# Altium schematic sheet DAC_IO.SchDoc: DAC IO Board
size Tabloid; Date: 05/10/2023; Engineer: Terry D. Schevler; Revision: 1.0; SheetNumber: 1; SheetTotal: 3
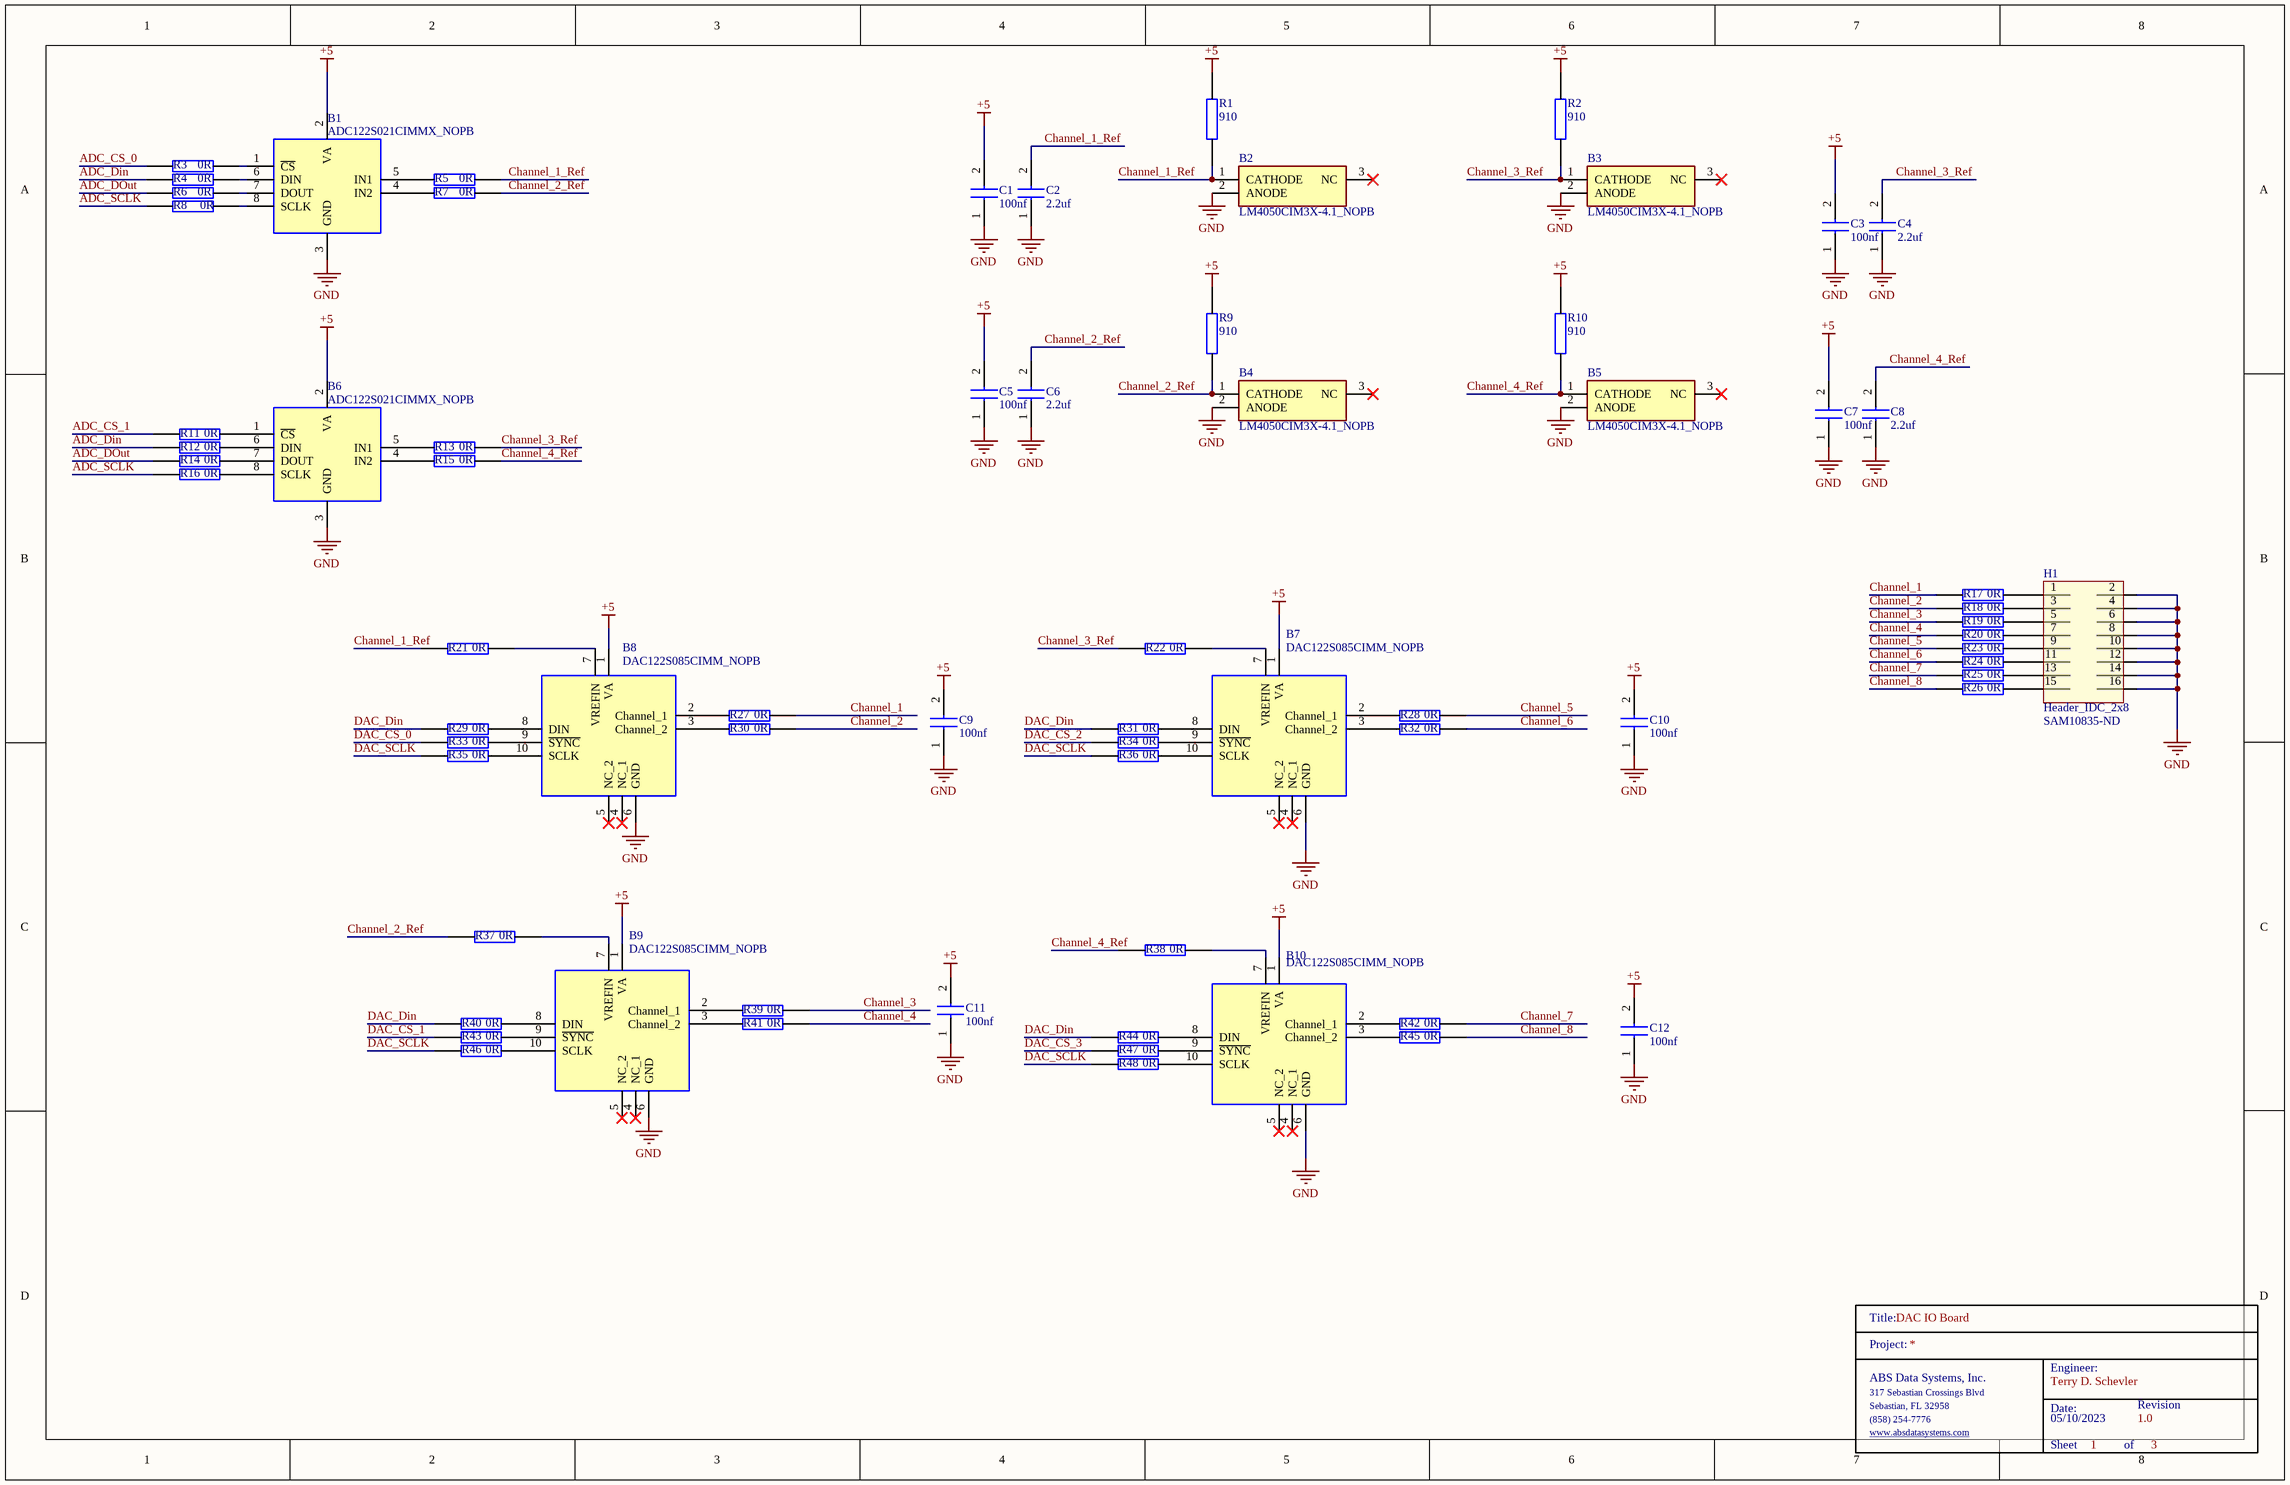
[diagram p0: DAC_IO.SchDoc]

## Parts
B1  ADC122S021CIMMX_NOPB  [SOP65P490X110-8N]
B2  LM4050CIM3X-4.1_NOPB  [SOT95P237X95-3N]
B3  LM4050CIM3X-4.1_NOPB  [SOT95P237X95-3N]
B4  LM4050CIM3X-4.1_NOPB  [SOT95P237X95-3N]
B5  LM4050CIM3X-4.1_NOPB  [SOT95P237X95-3N]
B6  ADC122S021CIMMX_NOPB  [SOP65P490X110-8N]
B7  DAC122S085CIMM_NOPB  [SOP50P490X110-10N]
B8  DAC122S085CIMM_NOPB  [SOP50P490X110-10N]
B9  DAC122S085CIMM_NOPB  [SOP50P490X110-10N]
B10  DAC122S085CIMM_NOPB  [SOP50P490X110-10N]
C1  100nf  [0603]
C2  2.2uf  [0603]
C3  100nf  [0603]
C4  2.2uf  [0603]
C5  100nf  [0603]
C6  2.2uf  [0603]
C7  100nf  [0603]
C8  2.2uf  [0603]
C9  100nf  [0603]
C10  100nf  [0603]
C11  100nf  [0603]
C12  100nf  [0603]
H1  Header_IDC_2x8  Supplier Part Number 1: SAM10835-ND  [HEADER16]
R1  910  [0603]
R2  910  [0603]
R3  0R  [0603]
R4  0R  [0603]
R5  0R  [0603]
R6  0R  [0603]
R7  0R  [0603]
R8  0R  [0603]
R9  910  [0603]
R10  910  [0603]
R11  0R  [0603]
R12  0R  [0603]
R13  0R  [0603]
R14  0R  [0603]
R15  0R  [0603]
R16  0R  [0603]
R17  0R  [0603]
R18  0R  [0603]
R19  0R  [0603]
R20  0R  [0603]
R21  0R  [0603]
R22  0R  [0603]
R23  0R  [0603]
R24  0R  [0603]
R25  0R  [0603]
R26  0R  [0603]
R27  0R  [0603]
R28  0R  [0603]
R29  0R  [0603]
R30  0R  [0603]
R31  0R  [0603]
R32  0R  [0603]
R33  0R  [0603]
R34  0R  [0603]
R35  0R  [0603]
R36  0R  [0603]
R37  0R  [0603]
R38  0R  [0603]
R39  0R  [0603]
R40  0R  [0603]
R41  0R  [0603]
R42  0R  [0603]
R43  0R  [0603]
R44  0R  [0603]
R45  0R  [0603]
R46  0R  [0603]
R47  0R  [0603]
R48  0R  [0603]
TitleBlock_1  TitleBlock  (value not drawn)  (graphical)

## Nets
+5: B1.2(VA) B6.2(VA) B7.1(VA) B8.1(VA) B9.1(VA) B10.1(VA) C1.2 C3.2 C5.2 C7.2 C9.2 C10.2 C11.2 C12.2 R1.1 R2.1 R9.1 R10.1
GND: B1.3(GND) B2.2(ANODE) B3.2(ANODE) B4.2(ANODE) B5.2(ANODE) B6.3(GND) B7.6(GND) B8.6(GND) B9.6(GND) B10.6(GND) C1.1 C2.1 C3.1 C4.1 C5.1 C6.1 C7.1 C8.1 C9.1 C10.1 C11.1 C12.1 H1.2 H1.4 H1.6 H1.8 H1.10 H1.12 H1.14 H1.16
ADC_CS_0: R3.1
ADC_CS_1: R11.1
ADC_Din: R4.1 R12.1
ADC_DOut: R6.1 R14.1
ADC_SCLK: R8.1 R16.1
Channel_1: R17.1 R27.2
Channel_1_Ref: B2.1(CATHODE) C2.2 R1.2 R5.2 R21.1
Channel_2: R18.1 R30.2
Channel_2_Ref: B4.1(CATHODE) C6.2 R7.2 R9.2 R37.1
Channel_3: R19.1 R39.2
Channel_3_Ref: B3.1(CATHODE) C4.2 R2.2 R13.2 R22.1
Channel_4: R20.1 R41.2
Channel_4_Ref: B5.1(CATHODE) C8.2 R10.2 R15.2 R38.1
Channel_5: R23.1 R28.2
Channel_6: R24.1 R32.2
Channel_7: R25.1 R42.2
Channel_8: R26.1 R45.2
DAC_CS_0: R33.1
DAC_CS_1: R43.1
DAC_CS_2: R34.1
DAC_CS_3: R47.1
DAC_Din: R29.1 R31.1 R40.1 R44.1
DAC_SCLK: R35.1 R36.1 R46.1 R48.1
NetB1_1: B1.1(~{CS}) R3.2
NetB1_4: B1.4(IN2) R7.1
NetB1_5: B1.5(IN1) R5.1
NetB1_6: B1.6(DIN) R4.2
NetB1_7: B1.7(DOUT) R6.2
NetB1_8: B1.8(SCLK) R8.2
NetB6_1: B6.1(~{CS}) R11.2
NetB6_4: B6.4(IN2) R15.1
NetB6_5: B6.5(IN1) R13.1
NetB6_6: B6.6(DIN) R12.2
NetB6_7: B6.7(DOUT) R14.2
NetB6_8: B6.8(SCLK) R16.2
NetB7_2: B7.2(Channel_1) R28.1
NetB7_3: B7.3(Channel_2) R32.1
NetB7_7: B7.7(VREFIN) R22.2
NetB7_8: B7.8(DIN) R31.2
NetB7_9: B7.9(~{SYNC}) R34.2
NetB7_10: B7.10(SCLK) R36.2
NetB8_2: B8.2(Channel_1) R27.1
NetB8_3: B8.3(Channel_2) R30.1
NetB8_7: B8.7(VREFIN) R21.2
NetB8_8: B8.8(DIN) R29.2
NetB8_9: B8.9(~{SYNC}) R33.2
NetB8_10: B8.10(SCLK) R35.2
NetB9_2: B9.2(Channel_1) R39.1
NetB9_3: B9.3(Channel_2) R41.1
NetB9_7: B9.7(VREFIN) R37.2
NetB9_8: B9.8(DIN) R40.2
NetB9_9: B9.9(~{SYNC}) R43.2
NetB9_10: B9.10(SCLK) R46.2
NetB10_2: B10.2(Channel_1) R42.1
NetB10_3: B10.3(Channel_2) R45.1
NetB10_7: B10.7(VREFIN) R38.2
NetB10_8: B10.8(DIN) R44.2
NetB10_9: B10.9(~{SYNC}) R47.2
NetB10_10: B10.10(SCLK) R48.2
NetH1_1: H1.1 R17.2
NetH1_3: H1.3 R18.2
NetH1_5: H1.5 R19.2
NetH1_7: H1.7 R20.2
NetH1_9: H1.9 R23.2
NetH1_11: H1.11 R24.2
NetH1_13: H1.13 R25.2
NetH1_15: H1.15 R26.2

Not connected (* = marked no-connect by the designer): B2 3(NC)*; B3 3(NC)*; B4 3(NC)*; B5 3(NC)*; B7 4(NC_1)* 5(NC_2)*; B8 4(NC_1)* 5(NC_2)*; B9 4(NC_1)* 5(NC_2)*; B10 4(NC_1)* 5(NC_2)*

## Notes on the sheet
- (in symbol TitleBlock) Title:; Project:; Engineer:; ABS Data Systems, Inc.; 317 Sebastian Crossings Blvd; Sebastian, FL 32958; Date:; Revision; (858) 254-7776; www.absdatasystems.com; Sheet; of

## Library data of the parts
B1 B6 = ADC122S021CIMMX_NOPB: 2 Channel, 50 ksps to 200 ksps 12-Bit A/D Converter; Manufacturer_Name: Texas Instruments; Manufacturer_Part_Number: ADC122S021CIMMX/NOPB; Geometry.Height: 1.1mm; Mouser Part Number: 926-A122S021CIMMXNPB; Mouser Price/Stock: https://www.mouser.co.uk/ProductDetail/Texas-Instruments/ADC122S021CIMMX-NOPB/?qs=7X5t%252BdzoRHB2bC7Teu8H3A%3D%3D; Datasheet Link: http://www.ti.com/lit/gpn/ADC122S021
B2-B5 = LM4050CIM3X-4.1_NOPB: 50ppm/C Precision Micropower Shunt Voltage Reference; Manufacturer_Name: Texas Instruments; Manufacturer_Part_Number: LM4050CIM3X-4.1/NOPB; Geometry.Height: 0.95mm; Mouser Part Number: 926-LM4050CIM3X41NPB; Mouser Price/Stock: https://www.mouser.co.uk/ProductDetail/Texas-Instruments/LM4050CIM3X-4.1-NOPB?qs=QbsRYf82W3Em%2F29oRlpByg%3D%3D; Datasheet Link: http://www.ti.com/lit/gpn/lm4050-n
B7-B10 = DAC122S085CIMM_NOPB: 12-Bit Micro Power DUAL Digital-to-Analog Converter with Rail-to-Rail Output; Manufacturer_Name: Texas Instruments; Manufacturer_Part_Number: DAC122S085CIMM/NOPB; Geometry.Height: 1.1mm; Mouser Part Number: 926-DAC122S085CIMMNO; Mouser Price/Stock: https://www.mouser.co.uk/ProductDetail/Texas-Instruments/DAC122S085CIMM-NOPB/?qs=7X5t%252BdzoRHCSswOz%252BE6yGA%3D%3D; Datasheet Link: http://www.ti.com/lit/gpn/dac122s085
C1 C3 C5 C7 C9-C12 = CL10B104JB8NNNC: Samsung Electro-Mechanics 0603 100nf
C2 C4 C6 C8 = CL10B225KP8NNNC: Samsung Electro-Mechanics 0603 2.2uf
H1 = Header_IDC_2x8: 16 Pin 2x8 Through Hold IDC Connector; Manufacturer: Samtec; Manufacturer Part Number: TST-108-01-G-D; Number of Contacts: 16; Gender: Male; Connector Type: Male Pin; Pitch: 2.54mm; Row Spacing: 0.1inch; Supplier 1: Digi-Key; RoHS: Yes; Category: Headers and Wire Housings; Stock 1: 227; Pricing 1: 1=2.85000, 10=2.73600, 100=2.28000, 500=1.93800, 1000=1.65300, 5000=1.48200 (USD); Mount: Through Hole; Contact Plating: Gold; Contact Material: Bronze; Housing Material: Polyester; Housing Color: Black; Color: Black; Min Operating Temperature: -55°C; Max Operating Temperature: 125°C; Number of Rows: 2; Termination: Solder; Packaging: Rail/Tube; Orientation: Straight; Number of Positions: 16; Length: 27.94mm; Depth: 9.27mm; Contact Mating Length: 0.25inch; REACH SVHC: No SVHC; ComponentLink1URL: https://datasheet.ciiva.com/739/tst-mkt-739845.pdf?src-supplier=Digi-Key; ComponentLink1Description: https://datasheet.ciiva.com/739/tst-mkt-739845.pdf?src-supplier=Digi-Key; ComponentLink2URL: https://datasheet.ciiva.com/10018/htst-10018510.pdf?src-supplier=Avnet; ComponentLink2Description: https://datasheet.ciiva.com/10018/htst-10018510.pdf?src-supplier=Avnet
R1 R2 R9 R10 = RT0603BRC07910RL: YAGEO 0603 910 ohm; Manufacturer_Name: KEMET; Manufacturer_Part_Number: RC0603JR-070RL; Geometry.Height: 0.55mm; Mouser Part Number: 603-RC0603JR-070RL; Mouser Price/Stock: https://www.mouser.co.uk/ProductDetail/YAGEO/RC0603JR-070RL?qs=2cAdsCoAWRGWyPcuXgGiXQ%3D%3D; Datasheet Link: https://datasheet.datasheetarchive.com/originals/distributors/Datasheets_SAMA/902f9e387b938f871d31120f5fc1d65e.pdf
R3-R8 R11-R48 = RC0603JR-070RL: YAGEO 0603 0 ohm; Manufacturer_Name: KEMET; Geometry.Height: 0.55mm; Mouser Part Number: 603-RC0603JR-070RL; Mouser Price/Stock: https://www.mouser.co.uk/ProductDetail/YAGEO/RC0603JR-070RL?qs=2cAdsCoAWRGWyPcuXgGiXQ%3D%3D; Manufacturer_Part_Number: RC0603JR-070RL; Datasheet Link: https://datasheet.datasheetarchive.com/originals/distributors/Datasheets_SAMA/902f9e387b938f871d31120f5fc1d65e.pdf